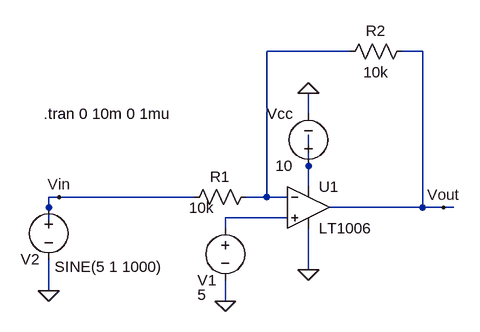
[diagram p0: schematic opamp_positive_bias.asc]
opamp_positive_bias.asc, the LTspice schematic file:
Version 4
SHEET 1 880 680
WIRE 384 192 256 192
WIRE 496 192 464 192
WIRE 320 288 320 256
WIRE 320 368 320 320
WIRE 320 400 320 368
WIRE -64 416 -80 416
WIRE 144 416 -64 416
WIRE 256 416 256 192
WIRE 256 416 224 416
WIRE 288 416 256 416
WIRE -80 432 -80 416
WIRE 496 432 496 192
WIRE 496 432 352 432
WIRE 528 432 496 432
WIRE 544 432 528 432
WIRE 288 448 192 448
WIRE -80 464 -80 432
WIRE 192 464 192 448
WIRE 320 528 320 464
WIRE -80 560 -80 512
WIRE 192 576 192 544
FLAG 320 528 0
FLAG 192 576 0
FLAG 528 432 Vout
FLAG 320 256 0
FLAG -80 560 0
FLAG -64 416 Vin
SYMBOL LT1006 320 368 R0
SYMATTR InstName U1
SYMBOL res 128 432 R270
WINDOW 0 32 56 VTop 2
WINDOW 3 15 28 VBottom 2
SYMATTR InstName R1
SYMATTR Value 10k
SYMBOL res 368 208 R270
WINDOW 0 32 56 VTop 2
WINDOW 3 0 56 VBottom 2
SYMATTR InstName R2
SYMATTR Value 10k
SYMBOL voltage 192 448 R0
WINDOW 0 -43 96 Left 2
WINDOW 3 -43 118 Left 2
SYMATTR InstName V1
SYMATTR Value 5
SYMBOL voltage 320 384 R180
WINDOW 0 24 96 Left 2
WINDOW 3 24 16 Left 2
SYMATTR InstName Vcc
SYMATTR Value 10
SYMBOL voltage -80 416 R0
WINDOW 0 -43 96 Left 2
WINDOW 3 9 107 Left 2
SYMATTR InstName V2
SYMATTR Value SINE(5 1 1000)
TEXT -88 288 Left 2 !.tran 0 10m 0 1mu

The netlist it stands for:
* opamp_positive_bias.asc
XU1 N003 N001 N002 0 Vout LT1006  ; pins In+ In- V+ V- OUT
R1 Vin N001 10k
R2 N001 Vout 10k
V1 N003 0 5
Vcc N002 0 10
V2 Vin 0 SINE(5 1 1000)
.tran 0 10m 0 1mu
.lib LTC.lib
.backanno
.end